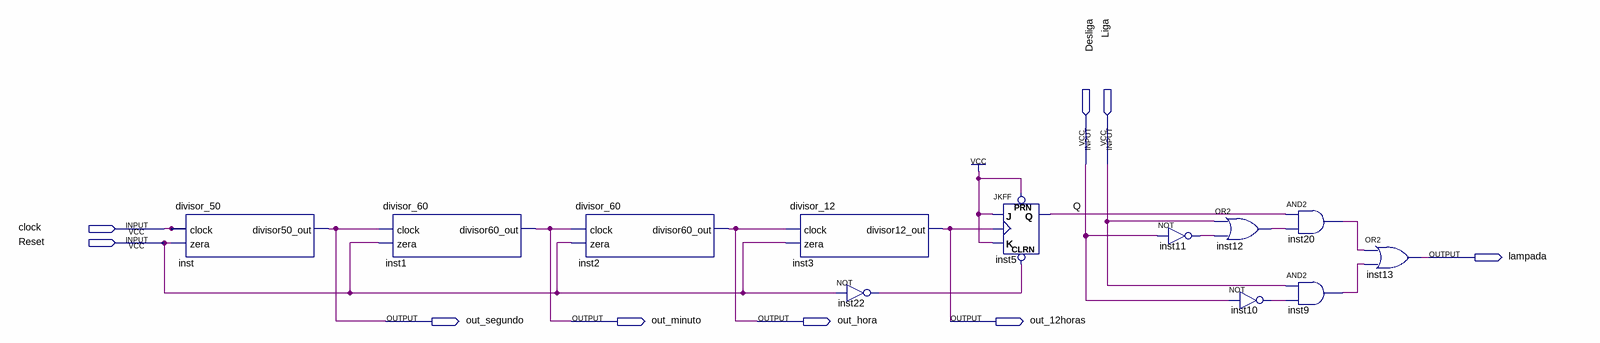
[diagram p0: schematic sheet]
// Quartus schematic circuito_temporizador.bdf as structural Verilog: 12 symbols, 9 pins
module circuito_temporizador (
  input  Desliga,
  input  Liga,
  input  clock,
  input  Reset,
  output lampada,
  output out_segundo,
  output out_minuto,
  output out_hora,
  output out_12horas
);

  wire inst9_out, inst10_out, inst11_out, inst12_out, inst20_out, inst22_out, Q;

  divisor_50 inst (.clock(clock), .zera(Reset), .divisor50_out(out_segundo));
  divisor_60 inst1 (.clock(out_segundo), .zera(Reset), .divisor60_out(out_minuto));
  divisor_60 inst2 (.clock(out_minuto), .zera(Reset), .divisor60_out(out_hora));
  divisor_12 inst3 (.clock(out_hora), .zera(Reset), .divisor12_out(out_12horas));
  not inst22 (inst22_out, Reset);
  JKFF inst5 (.PRN(1'b1), .CLRN(inst22_out), .K(1'b1), .J(1'b1), .CLK(out_12horas), .Q(Q));
  not inst11 (inst11_out, Desliga);
  or inst12 (inst12_out, Liga, inst11_out);
  not inst10 (inst10_out, Desliga);
  and inst20 (inst20_out, Q, inst12_out);
  and inst9 (inst9_out, Liga, inst10_out);
  or inst13 (lampada, inst20_out, inst9_out);
endmodule
